# Altium schematic sheet Power.SchDoc
size Letter
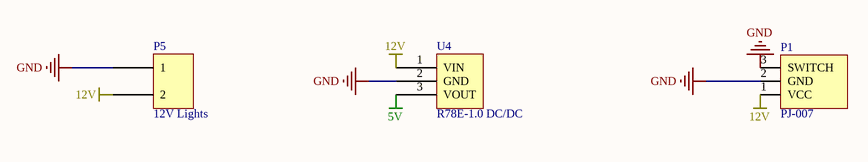
[diagram p0: Power.SchDoc]

## Parts
P1  PJ-007  [BARREL JACK PJ007]
P5  12V Lights  [Molex Mini-Fit Jr 2x1]
U4  R78E-1.0 DC/DC  [R78-1.0]

## Nets
5V: U4.3(VOUT)
12V: P1.1(VCC) P5.2 U4.1(VIN)
GND: P1.2(GND) P1.3(SWITCH) P5.1 U4.2(GND)

## Library data of the parts
P1 = Component_1
P5 = Molex Mini-Fit 1x2
U4 = R78E-1.0